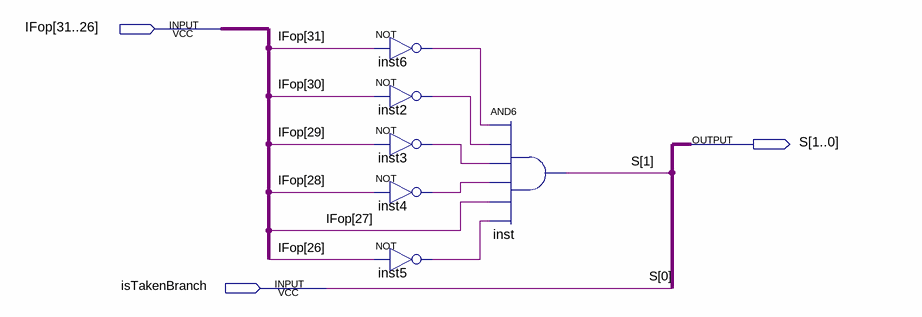
[diagram p0: schematic sheet]
// Quartus schematic IF_OrangeBox.bdf as structural Verilog: 6 symbols, 3 pins
module IF_OrangeBox (
  input  [31:26] IFop,
  input  isTakenBranch,
  output [1:0] S
);

  wire inst2_out, inst3_out, inst4_out, inst5_out, inst6_out;

  not inst6 (inst6_out, IFop[31]);
  not inst2 (inst2_out, IFop[30]);
  not inst3 (inst3_out, IFop[29]);
  not inst4 (inst4_out, IFop[28]);
  not inst5 (inst5_out, IFop[26]);
  and inst (S[1], inst6_out, inst2_out, inst3_out, inst4_out, IFop[27], inst5_out);

  assign S[0] = isTakenBranch;
endmodule
